# Altium schematic sheet [9]-CAMERA_POWER_CONTROLLER.SchDoc
size A4
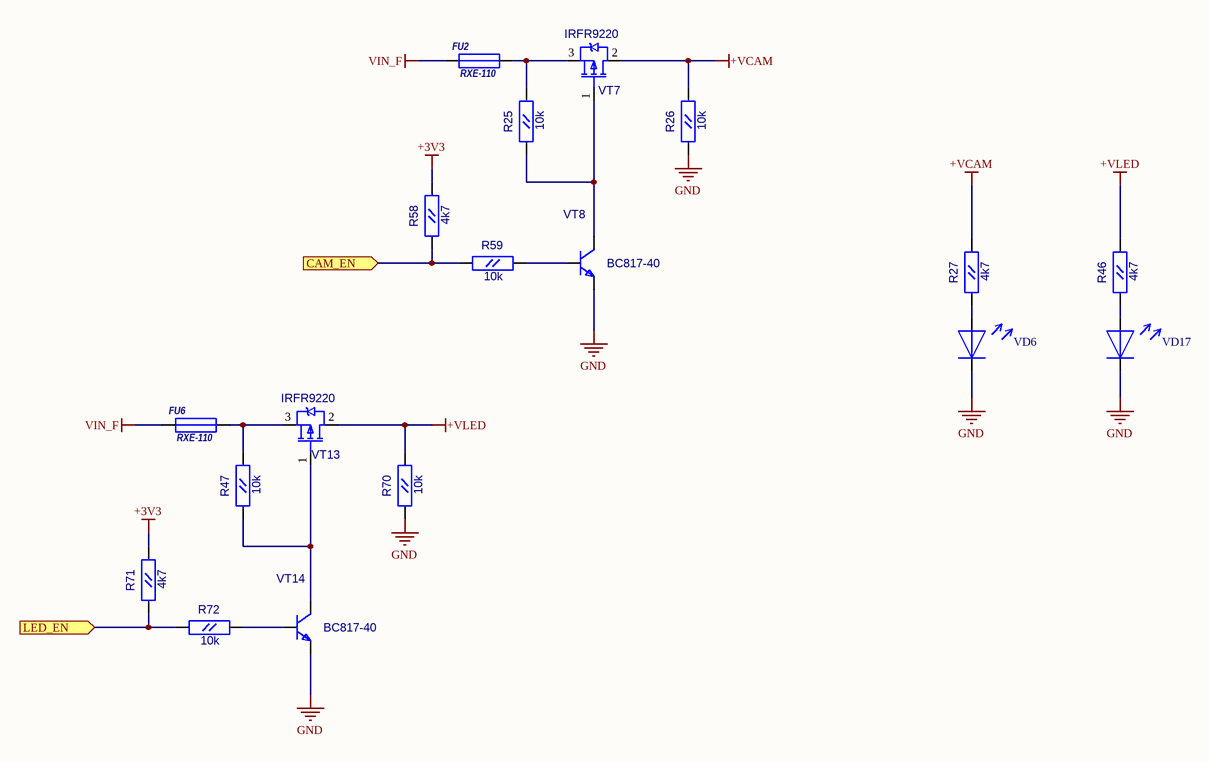
[diagram p0: [9]-CAMERA_POWER_CONTROLLER.SchDoc]

## Parts
FU2  RXE-110  [RXE-110]
FU6  RXE-110  [RXE-110]
R25  10k  [RC0603]
R26  10k  [RC0603]
R27  4k7  [RC0603]
R46  4k7  [RC0603]
R47  10k  [RC0603]
R58  4k7  [RC0603]
R59  10k  [RC0603]
R70  10k  [RC0603]
R71  4k7  [RC0603]
R72  10k  [RC0603]
VD6  LED_0805  [LED0805]  (value not drawn)
VD17  LED_0805  [LED0805]  (value not drawn)
VT7  IRFR9220  [D-PAK(TO-252AA)]
VT8  BC817-40  [SOT-23(123)]
VT13  IRFR9220  [D-PAK(TO-252AA)]
VT14  BC817-40  [SOT-23(123)]

## Ports
CAM_EN (in), LED_EN (in)

## Nets
+3V3: R58.2(B) R71.2(B)
+VCAM: R26.2(B) R27.2(B) VT7.2(D)
+VLED: R46.2(B) R70.2(B) VT13.2(D)
GND: R26.1(A) R70.1(A) VD6.2 VD17.2 VT8.2(E) VT14.2(E)
VIN_F: FU2.1 FU6.1
CAM_EN: R58.1(A) R59.1(A) ; port CAM_EN
LED_EN: R71.1(A) R72.1(A) ; port LED_EN
NetFU2_2: FU2.2 R25.2(B) VT7.3(S)
NetFU6_2: FU6.2 R47.2(B) VT13.3(S)
NetR25_1: R25.1(A) VT7.1(G) VT8.3(C)
NetR27_1: R27.1(A) VD6.1
NetR46_1: R46.1(A) VD17.1
NetR47_1: R47.1(A) VT13.1(G) VT14.3(C)
NetR59_2: R59.2(B) VT8.1(B)
NetR72_2: R72.2(B) VT14.1(B)

## Library data of the parts
R25-R27 R46 R47 R58 R59 R70-R72 = RC0603
  R25 R26 R47 R59 R70 R72: Value: 10k
  R27 R46 R58 R71: Value: 4k7
VT7 VT13 = IRFR9220: HEXFET Power MOSFET; OriginalName: IRLML5103; ComponentField7: Published 8-Jun-2000; Value: IRFR9220
VT8 VT14 = BC846BLT1: NPN 500ma transistor; ComponentField7: Published 29-Sep-2000; OriginalName: BC846BLT1; Value: BC817-40
FU2 FU6 = RXE-110: Value: *
VD6 VD17 = LED_0805: Value: LED_0805